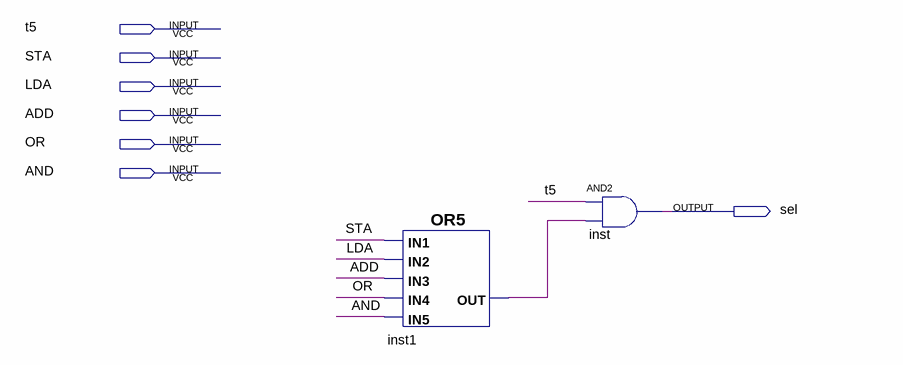
[diagram p0: schematic sheet]
// Quartus schematic sel.bdf as structural Verilog: 2 symbols, 7 pins
module sel (
  input  t5,
  input  STA,
  input  LDA,
  input  ADD,
  input  OR,
  input  AND,
  output sel
);

  wire inst1_out;

  or inst1 (inst1_out, STA, LDA, ADD, OR, AND);
  and inst (sel, t5, inst1_out);
endmodule
